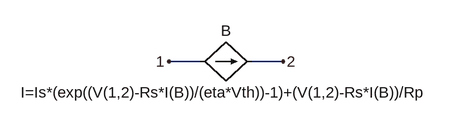
[diagram p0: schematic ExtendedSchockleyDiode.asc]
ExtendedSchockleyDiode.asc, the LTspice schematic file:
Version 4
SHEET 1 880 680
WIRE 128 192 80 192
WIRE 256 192 208 192
FLAG 80 192 1
FLAG 256 192 2
SYMBOL bi2 208 192 R90
WINDOW 0 -32 40 VBottom 2
WINDOW 3 32 40 VTop 2
SYMATTR InstName B
SYMATTR Value I=Is*(exp((V(1,2)-Rs*I(B))/(eta*Vth))-1)+(V(1,2)-Rs*I(B))/Rp

The netlist it stands for:
* ExtendedSchockleyDiode.asc
B 1 2 I=Is*(exp((V(1,2)-Rs*I(B))/(eta*Vth))-1)+(V(1,2)-Rs*I(B))/Rp
.backanno
.end